# Altium schematic sheet 01-POWER.SchDoc
size A4
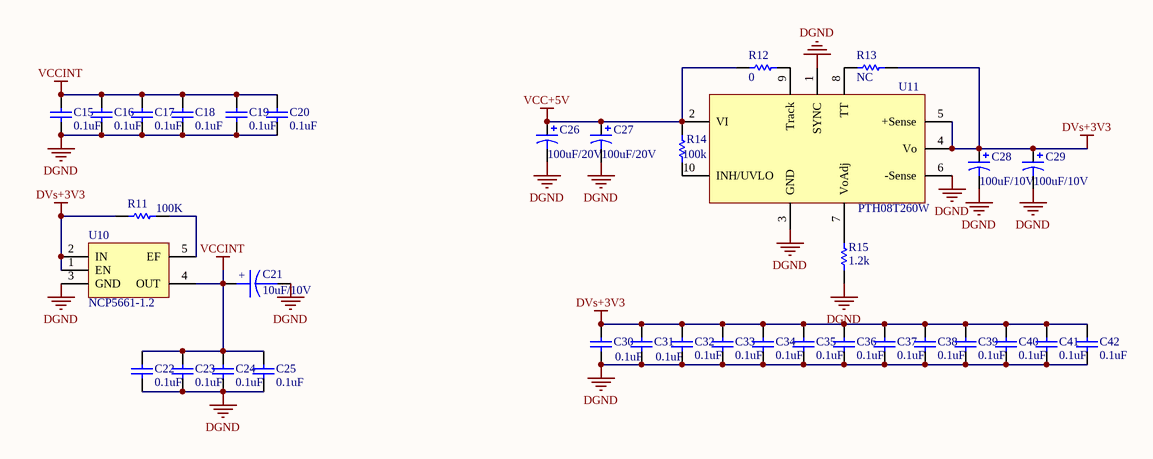
[diagram p0: 01-POWER.SchDoc]

## Parts
C15  0.1uF  [0805-X]
C16  0.1uF  [0805-X]
C17  0.1uF  [0805-X]
C18  0.1uF  [0805-X]
C19  0.1uF  [0805-X]
C20  0.1uF  [0805-X]
C21  10uF/10V  [CC3225-1210]
C22  0.1uF  [0805-X]
C23  0.1uF  [0805-X]
C24  0.1uF  [0805-X]
C25  0.1uF  [0805-X]
C26  100uF/20V  [CC7343]
C27  100uF/20V  [CC7343]
C28  100uF/10V  [CC7343]
C29  100uF/10V  [CC7343]
C30  0.1uF  [0805-X]
C31  0.1uF  [0805-X]
C32  0.1uF  [0805-X]
C33  0.1uF  [0805-X]
C34  0.1uF  [0805-X]
C35  0.1uF  [0805-X]
C36  0.1uF  [0805-X]
C37  0.1uF  [0805-X]
C38  0.1uF  [0805-X]
C39  0.1uF  [0805-X]
C40  0.1uF  [0805-X]
C41  0.1uF  [0805-X]
C42  0.1uF  [0805-X]
R11  100K  [0805]
R12  0  [CR2012-0805]
R13  NC  [CR2012-0805]
R14  100k  [CR2012-0805]
R15  1.2k  [CR2012-0805]
U10  NCP5661-1.2  [DPAK5]
U11  PTH08T260W  [TI_R-PDSS-T10]

## Nets
DGND: C15.1 C16.1 C17.1 C18.1 C19.1 C20.1 C21.2 C22.1 C23.1 C24.1 C25.1 C26.2 C27.2 C28.2 C29.2 C30.1 C31.1 C32.1 C33.1 C34.1 C35.1 C36.1 C37.1 C38.1 C39.1 C40.1 C41.1 C42.1 R15.1 U10.3(GND) U11.1(SYNC) U11.3(GND) U11.6(-Sense)
DVs+3V3: C28.1 C29.1 C30.2 C31.2 C32.2 C33.2 C34.2 C35.2 C36.2 C37.2 C38.2 C39.2 C40.2 C41.2 C42.2 R11.1 R13.1 U10.1(EN) U10.2(IN) U11.4(Vo) U11.5(+Sense)
VCC+5V: C26.1 C27.1 R12.2 R14.2 U11.2(VI)
VCCINT: C15.2 C16.2 C17.2 C18.2 C19.2 C20.2 C21.1 C22.2 C23.2 C24.2 C25.2 U10.4(OUT)
NetR11_2: R11.2 U10.5(EF)
NetR12_1: R12.1 U11.9(Track)
NetR13_2: R13.2 U11.8(TT)
NetR14_1: R14.1 U11.10(INH/UVLO)
NetR15_2: R15.2 U11.7(VoAdj)

## Notes on the sheet
- (in symbol CAPACITOR POL) +

## Library data of the parts
C15 = Cap: Capacitor; Published: 8-Jun-2000; LatestRevisionDate: 17-Jul-2002; LatestRevisionNote: Re-released for DXP Platform.; PackageReference: RAD-0.3; Publisher: Altium Limited; Value: 0.1uF
C16-C20 = Cap: Capacitor; Value: 100pF; Published: 8-Jun-2000; LatestRevisionDate: 17-Jul-2002; LatestRevisionNote: Re-released for DXP Platform.; PackageReference: RAD-0.3; Publisher: Altium Limited
C21 = CAPACITOR POL: Capacitor
C22-C25 C30-C42 = Cap Semi: Capacitor (Semiconductor SIM Model); Published: 8-Jun-2000; LatestRevisionDate: 17-Jul-2002; LatestRevisionNote: Re-released for DXP Platform.; PackageReference: C1206; Publisher: Altium Limited; Value: 0.1uF
C26 C27 = Cap Pol1: 钽电容,25V; Published: 8-Jun-2000; LatestRevisionDate: 17-Jul-2002; LatestRevisionNote: Re-released for DXP Platform.; PackageReference: RB7.6-15; Publisher: Altium Limited; Value: 100uF/20V
C28 C29 = Cap Pol1: 10V, X7R; Published: 8-Jun-2000; LatestRevisionDate: 17-Jul-2002; LatestRevisionNote: Re-released for DXP Platform.; PackageReference: RB7.6-15; Publisher: Altium Limited; Value: 100uF/10V
R11 = Res Semi: Semiconductor Resistor; Published: 8-Jun-2000; LatestRevisionDate: 17-Jul-2002; LatestRevisionNote: Re-released for DXP Platform.; PackageReference: AXIAL-0.5; Publisher: Altium Limited; Value: 100K
R12-R15 = Res1: Resistor; Published: 8-Jun-2000; LatestRevisionDate: 17-Jul-2002; LatestRevisionNote: Re-released for DXP Platform.; PackageReference: AXIAL-0.3; Publisher: Altium Limited
  R12: Value: 0
  R13: Value: NC
  R14: Value: 100k
  R15: Value: 1.2k
U10 = NCP5661
U11 = PTH08T230W: TI电源模块